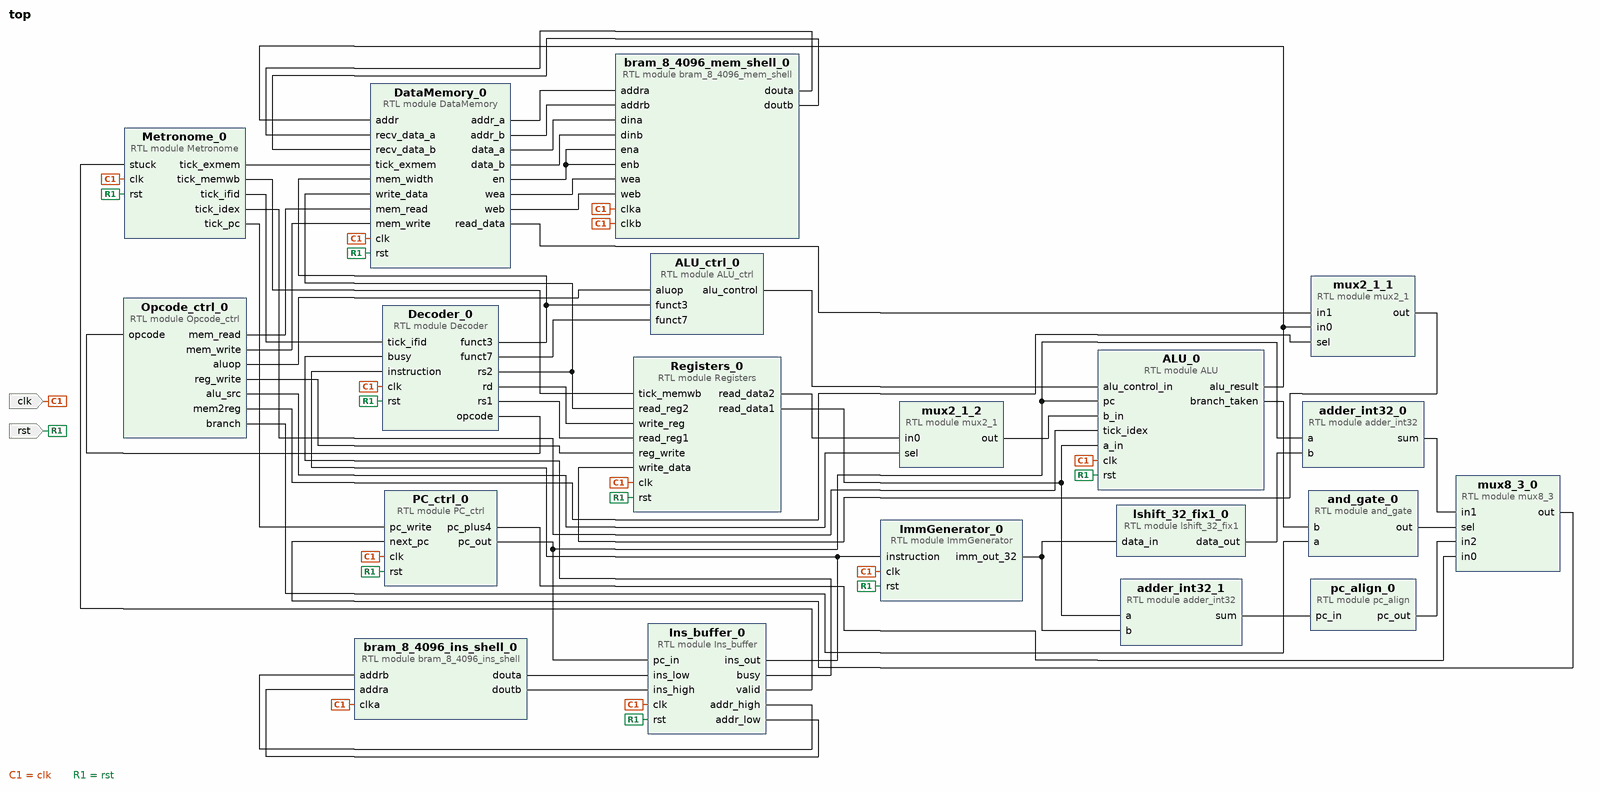
[diagram p0: block diagram of the top level]
# Vivado block design top, xc7a100tcsg324-1, Vivado 2022.2
create_bd_design top

create_bd_port -dir I clk
create_bd_port -dir I rst

create_bd_cell -type module -reference mux2_1 mux2_1_1
create_bd_cell -type module -reference mux2_1 mux2_1_2
create_bd_cell -type module -reference adder_int32 adder_int32_0
create_bd_cell -type module -reference PC_ctrl PC_ctrl_0
create_bd_cell -type module -reference Decoder Decoder_0
create_bd_cell -type module -reference Registers Registers_0
create_bd_cell -type module -reference Metronome Metronome_0
create_bd_cell -type module -reference Opcode_ctrl Opcode_ctrl_0
create_bd_cell -type module -reference ALU_ctrl ALU_ctrl_0
create_bd_cell -type module -reference DataMemory DataMemory_0
create_bd_cell -type module -reference lshift_32_fix1 lshift_32_fix1_0
create_bd_cell -type module -reference adder_int32 adder_int32_1
create_bd_cell -type module -reference and_gate and_gate_0
create_bd_cell -type module -reference pc_align pc_align_0
create_bd_cell -type module -reference mux8_3 mux8_3_0
create_bd_cell -type module -reference ImmGenerator ImmGenerator_0
create_bd_cell -type module -reference ALU ALU_0
create_bd_cell -type module -reference bram_8_4096_mem_shell bram_8_4096_mem_shell_0
create_bd_cell -type module -reference Ins_buffer Ins_buffer_0
create_bd_cell -type module -reference bram_8_4096_ins_shell bram_8_4096_ins_shell_0

# ---- connections ----

connect_bd_net [get_bd_pins ALU_0/alu_result] [get_bd_pins mux2_1_1/in0] [get_bd_pins DataMemory_0/addr]
connect_bd_net [get_bd_pins ALU_0/branch_taken] [get_bd_pins and_gate_0/b]
connect_bd_net [get_bd_pins ALU_ctrl_0/alu_control] [get_bd_pins ALU_0/alu_control_in]
connect_bd_net [get_bd_pins DataMemory_0/addr_a] [get_bd_pins bram_8_4096_mem_shell_0/addra]
connect_bd_net [get_bd_pins DataMemory_0/addr_b] [get_bd_pins bram_8_4096_mem_shell_0/addrb]
connect_bd_net [get_bd_pins DataMemory_0/data_a] [get_bd_pins bram_8_4096_mem_shell_0/dina]
connect_bd_net [get_bd_pins DataMemory_0/data_b] [get_bd_pins bram_8_4096_mem_shell_0/dinb]
connect_bd_net [get_bd_pins DataMemory_0/en] [get_bd_pins bram_8_4096_mem_shell_0/ena] [get_bd_pins bram_8_4096_mem_shell_0/enb]
connect_bd_net [get_bd_pins DataMemory_0/read_data] [get_bd_pins mux2_1_1/in1]
connect_bd_net [get_bd_pins DataMemory_0/wea] [get_bd_pins bram_8_4096_mem_shell_0/wea]
connect_bd_net [get_bd_pins DataMemory_0/web] [get_bd_pins bram_8_4096_mem_shell_0/web]
connect_bd_net [get_bd_pins Decoder_0/funct3] [get_bd_pins ALU_ctrl_0/funct3] [get_bd_pins DataMemory_0/mem_width]
connect_bd_net [get_bd_pins Decoder_0/funct7] [get_bd_pins ALU_ctrl_0/funct7]
connect_bd_net [get_bd_pins Decoder_0/opcode] [get_bd_pins Opcode_ctrl_0/opcode]
connect_bd_net [get_bd_pins Decoder_0/rd] [get_bd_pins Registers_0/write_reg]
connect_bd_net [get_bd_pins Decoder_0/rs1] [get_bd_pins Registers_0/read_reg1]
connect_bd_net [get_bd_pins Decoder_0/rs2] [get_bd_pins Registers_0/read_reg2] [get_bd_pins DataMemory_0/write_data]
connect_bd_net [get_bd_pins ImmGenerator_0/imm_out_32] [get_bd_pins lshift_32_fix1_0/data_in] [get_bd_pins adder_int32_1/b]
connect_bd_net [get_bd_pins Ins_buffer_0/addr_high] [get_bd_pins bram_8_4096_ins_shell_0/addrb]
connect_bd_net [get_bd_pins Ins_buffer_0/addr_low] [get_bd_pins bram_8_4096_ins_shell_0/addra]
connect_bd_net [get_bd_pins Ins_buffer_0/busy] [get_bd_pins Decoder_0/busy]
connect_bd_net [get_bd_pins Ins_buffer_0/ins_out] [get_bd_pins Decoder_0/instruction] [get_bd_pins ImmGenerator_0/instruction]
connect_bd_net [get_bd_pins Ins_buffer_0/valid] [get_bd_pins Metronome_0/stuck]
connect_bd_net [get_bd_pins Metronome_0/tick_exmem] [get_bd_pins DataMemory_0/tick_exmem]
connect_bd_net [get_bd_pins Metronome_0/tick_idex] [get_bd_pins ALU_0/tick_idex]
connect_bd_net [get_bd_pins Metronome_0/tick_ifid] [get_bd_pins Decoder_0/tick_ifid]
connect_bd_net [get_bd_pins Metronome_0/tick_memwb] [get_bd_pins Registers_0/tick_memwb]
connect_bd_net [get_bd_pins Metronome_0/tick_pc] [get_bd_pins PC_ctrl_0/pc_write]
connect_bd_net [get_bd_pins Opcode_ctrl_0/alu_src] [get_bd_pins mux2_1_2/sel]
connect_bd_net [get_bd_pins Opcode_ctrl_0/aluop] [get_bd_pins ALU_ctrl_0/aluop]
connect_bd_net [get_bd_pins Opcode_ctrl_0/branch] [get_bd_pins and_gate_0/a]
connect_bd_net [get_bd_pins Opcode_ctrl_0/mem2reg] [get_bd_pins mux2_1_1/sel]
connect_bd_net [get_bd_pins Opcode_ctrl_0/mem_read] [get_bd_pins DataMemory_0/mem_read]
connect_bd_net [get_bd_pins Opcode_ctrl_0/mem_write] [get_bd_pins DataMemory_0/mem_write]
connect_bd_net [get_bd_pins Opcode_ctrl_0/reg_write] [get_bd_pins Registers_0/reg_write]
connect_bd_net [get_bd_pins PC_ctrl_0/pc_out] [get_bd_pins adder_int32_0/a] [get_bd_pins ALU_0/pc] [get_bd_pins Ins_buffer_0/pc_in]
connect_bd_net [get_bd_pins PC_ctrl_0/pc_plus4] [get_bd_pins mux8_3_0/in0]
connect_bd_net [get_bd_pins Registers_0/read_data1] [get_bd_pins adder_int32_1/a] [get_bd_pins ALU_0/a_in]
connect_bd_net [get_bd_pins Registers_0/read_data2] [get_bd_pins mux2_1_2/in0]
connect_bd_net [get_bd_pins adder_int32_0/sum] [get_bd_pins mux8_3_0/in1]
connect_bd_net [get_bd_pins adder_int32_1/sum] [get_bd_pins pc_align_0/pc_in]
connect_bd_net [get_bd_pins and_gate_0/out] [get_bd_pins mux8_3_0/sel]
connect_bd_net [get_bd_pins bram_8_4096_ins_shell_0/douta] [get_bd_pins Ins_buffer_0/ins_low]
connect_bd_net [get_bd_pins bram_8_4096_ins_shell_0/doutb] [get_bd_pins Ins_buffer_0/ins_high]
connect_bd_net [get_bd_pins bram_8_4096_mem_shell_0/douta] [get_bd_pins DataMemory_0/recv_data_a]
connect_bd_net [get_bd_pins bram_8_4096_mem_shell_0/doutb] [get_bd_pins DataMemory_0/recv_data_b]
connect_bd_net [get_bd_ports clk] \
  [get_bd_pins PC_ctrl_0/clk] [get_bd_pins Decoder_0/clk] [get_bd_pins Registers_0/clk] [get_bd_pins Metronome_0/clk] \
  [get_bd_pins DataMemory_0/clk] [get_bd_pins ImmGenerator_0/clk] [get_bd_pins ALU_0/clk] \
  [get_bd_pins bram_8_4096_mem_shell_0/clka] [get_bd_pins bram_8_4096_mem_shell_0/clkb] [get_bd_pins Ins_buffer_0/clk] \
  [get_bd_pins bram_8_4096_ins_shell_0/clka]
connect_bd_net [get_bd_pins lshift_32_fix1_0/data_out] [get_bd_pins adder_int32_0/b]
connect_bd_net [get_bd_pins mux2_1_1/out] [get_bd_pins Registers_0/write_data]
connect_bd_net [get_bd_pins mux2_1_2/out] [get_bd_pins ALU_0/b_in]
connect_bd_net [get_bd_pins mux8_3_0/out] [get_bd_pins PC_ctrl_0/next_pc]
connect_bd_net [get_bd_pins pc_align_0/pc_out] [get_bd_pins mux8_3_0/in2]
connect_bd_net [get_bd_ports rst] \
  [get_bd_pins PC_ctrl_0/rst] [get_bd_pins Decoder_0/rst] [get_bd_pins Registers_0/rst] [get_bd_pins Metronome_0/rst] \
  [get_bd_pins DataMemory_0/rst] [get_bd_pins ImmGenerator_0/rst] [get_bd_pins ALU_0/rst] [get_bd_pins Ins_buffer_0/rst]

validate_bd_design
save_bd_design
